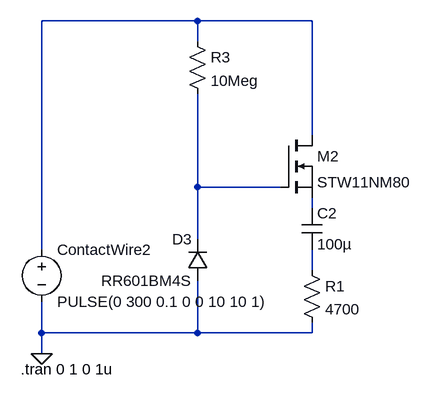
[diagram p0: schematic voltage_source_driver.asc]
voltage_source_driver.asc, the LTspice schematic file:
Version 4
SHEET 1 880 680
WIRE -80 -144 -320 -144
WIRE 96 -144 -80 -144
WIRE -80 -112 -80 -144
WIRE 96 32 96 -144
WIRE -80 112 -80 -32
WIRE 48 112 -80 112
WIRE 96 144 96 128
WIRE -80 192 -80 112
WIRE -320 208 -320 -144
WIRE 96 240 96 208
WIRE -320 336 -320 288
WIRE -80 336 -80 256
WIRE -80 336 -320 336
WIRE 96 336 96 320
WIRE 96 336 -80 336
WIRE -320 368 -320 336
FLAG -320 368 0
SYMBOL voltage -320 192 R0
WINDOW 123 0 0 Left 0
WINDOW 39 0 0 Left 0
SYMATTR InstName ContactWire2
SYMATTR Value PULSE(0 300 0.1 0 0 10 10 1)
SYMBOL nmos 48 32 R0
SYMATTR InstName M2
SYMATTR Value STW11NM80
SYMBOL res -96 -128 R0
SYMATTR InstName R3
SYMATTR Value 10Meg
SYMBOL cap 80 144 R0
SYMATTR InstName C2
SYMATTR Value 100µ
SYMBOL diode -64 256 R180
WINDOW 0 24 64 Left 2
WINDOW 3 24 0 Left 2
SYMATTR InstName D3
SYMATTR Value RR601BM4S
SYMATTR Description Zener Diode
SYMATTR Type zener
SYMBOL res 80 224 R0
SYMATTR InstName R1
SYMATTR Value 4700
TEXT -352 392 Left 2 !.tran 0 1 0 1u

The netlist it stands for:
* voltage_source_driver.asc
V§ContactWire2 N001 0 PULSE(0 300 0.1 0 0 10 10 1)
M2 N001 N002 N003 N003 STW11NM80
R3 N001 N002 10Meg
C2 N003 N004 100µ
D3 0 N002 RR601BM4S
R1 N004 0 4700
.model D D
.lib standard.dio
.model NMOS NMOS
.model PMOS PMOS
.lib standard.mos
.tran 0 1 0 1u
.backanno
.end